# Altium schematic sheet Camera connector.SchDoc
size A4; Revision: C.2(PCB.SCH)
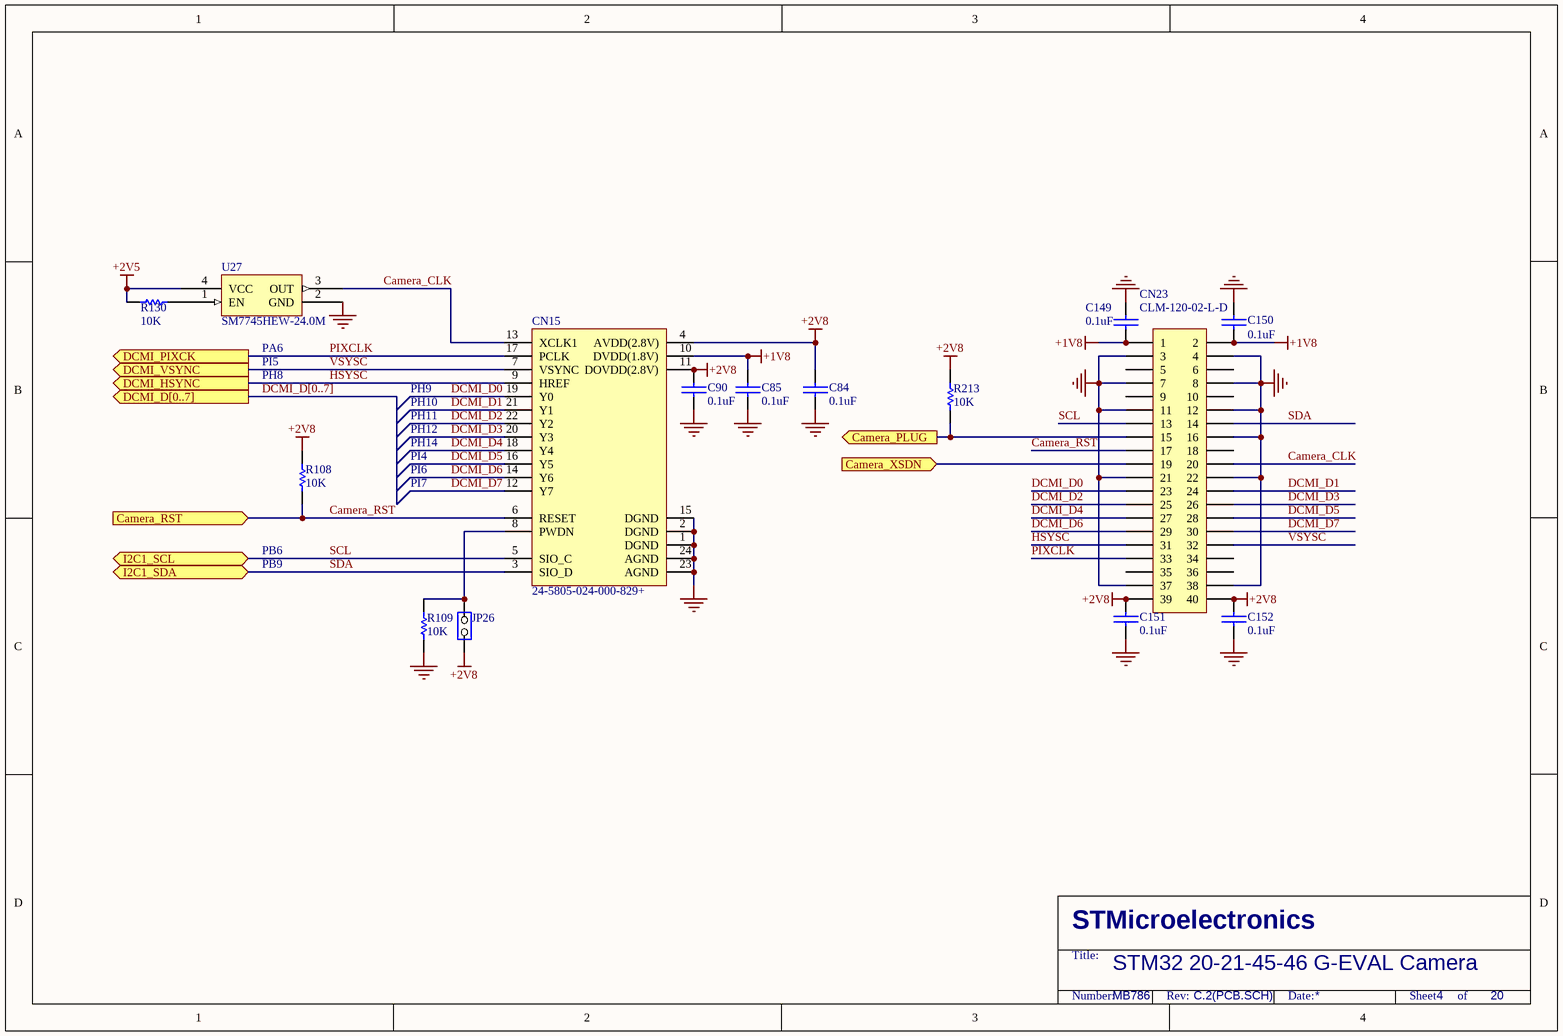
[diagram p0: Camera connector.SchDoc]

## Parts
C84  0.1uF  [0402C]
C85  0.1uF  [0402C]
C90  0.1uF  [0402C]
C149  0.1uF  [0402C]
C150  0.1uF  [0402C]
C151  0.1uF  [0402C]
C152  0.1uF  [0402C]
CN15  24-5805-024-000-829+  [24-5805-024-000-829]
CN23  CLM-120-02-L-D  [CLM-120-02-L-D]
JP26  (no value)  [SIP2]
R108  10K  [0402R]
R109  10K  [0402R]
R130  10K  [0402R]
R213  10K  [0402R]
U27  SM7745HEW-24.0M  [XTAL_5X7]

## Ports
Camera_PLUG (out), Camera_RST (in), Camera_XSDN (in), DCMI_D[0..7] (out), DCMI_HSYNC (out), DCMI_PIXCK (out), DCMI_VSYNC (out), I2C1_SCL (bidir), I2C1_SDA (bidir)

## Nets
+1V8: C85.2 C149.2 C150.2 CN15.10(DVDD(1.8V)) CN23.1 CN23.2
+2V5: R130.1 U27.4(VCC)
+2V8: C84.2 C90.2 C151.2 C152.2 CN15.4(AVDD(2.8V)) CN15.11(DOVDD(2.8V)) CN23.39 CN23.40 JP26.1(COMMON) R108.2 R213.2
GND: C84.1 C85.1 C90.1 C149.1 C150.1 C151.1 C152.1 CN15.1(DGND) CN15.2(DGND) CN15.15(DGND) CN15.23(AGND) CN15.24(AGND) CN23.3 CN23.4 CN23.7 CN23.8 CN23.11 CN23.12 CN23.16 CN23.21 CN23.22 CN23.37 CN23.38 R109.1 U27.2(GND)
Camera_CLK: CN15.13(XCLK1) CN23.20 U27.3(OUT)
Camera_PLUG: CN23.15 R213.1 ; port Camera_PLUG
Camera_RST: CN15.6(RESET) CN23.17 R108.1 ; port Camera_RST
Camera_XSDN: CN23.19 ; port Camera_XSDN
DCMI_D0: CN15.19(Y0) CN23.23
DCMI_D1: CN15.21(Y1) CN23.24
DCMI_D2: CN15.22(Y2) CN23.25
DCMI_D3: CN15.20(Y3) CN23.26
DCMI_D4: CN15.18(Y4) CN23.27
DCMI_D5: CN15.16(Y5) CN23.28
DCMI_D6: CN15.14(Y6) CN23.29
DCMI_D7: CN15.12(Y7) CN23.30
HSYSC: CN15.9(HREF) CN23.31 ; port DCMI_HSYNC
PIXCLK: CN15.17(PCLK) CN23.33 ; port DCMI_PIXCK
SCL: CN15.5(SIO_C) CN23.13 ; port I2C1_SCL
SDA: CN15.3(SIO_D) CN23.14 ; port I2C1_SDA
VSYSC: CN15.7(VSYNC) CN23.32 ; port DCMI_VSYNC
NetCN15_8: CN15.8(PWDN) JP26.2(NO) R109.2
NetR130_2: R130.2 U27.1(EN)

Not connected (* = marked no-connect by the designer): CN23 5 6 9 10 18 34 35 36

## Buses and harness runs
bus DCMI_D[0..7] = port DCMI_D[0..7]

## Notes on the sheet
- PH8
- PI5
- (near U27) PA6
- PH9
- PH10
- PH11
- PH12
- PH14
- PI4
- PI6
- PI7
- PB9
- PB6
- STM32 20-21-45-46 G-EVAL Camera
- MB786
- 4
- 20
- STMicroelectronics
- Title:
- Number:
- Rev:
- Date:
- Sheet       of

## Library data of the parts
C84 C85 C90 C149-C152 = CAP: Capacitor
CN23 = Header 20X2: Header, 20-Pin, Dual row; Revision: 17-Jul-2002: Re-released for DXP Platform.; Publisher: Altium Limited
JP26 = JP2
R108 R109 R130 R213 = Res1: Resistor; Value: 1K; Published: 8-Jun-2000; Revision: July-2002: Re-released for DXP Platform.; Publisher: Altium Limited
U27 = SM7745HEV-50.0M